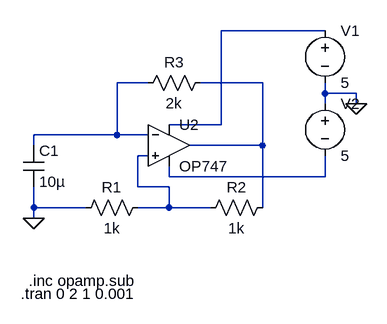
[diagram p0: schematic oscilador_opamp.asc]
oscilador_opamp.asc, the LTspice schematic file:
Version 4
SHEET 1 880 680
WIRE 512 -144 352 -144
WIRE 240 -64 192 -64
WIRE 416 -64 320 -64
WIRE 512 -48 512 -64
WIRE 560 -48 512 -48
WIRE 512 -32 512 -48
WIRE 560 -32 560 -48
WIRE 352 0 352 -144
WIRE 352 0 272 0
WIRE 192 16 192 -64
WIRE 192 16 64 16
WIRE 240 16 192 16
WIRE 64 32 64 16
WIRE 416 32 416 -64
WIRE 416 32 304 32
WIRE 240 48 224 48
WIRE 272 80 272 64
WIRE 512 80 512 48
WIRE 512 80 272 80
WIRE 224 96 224 48
WIRE 272 96 224 96
WIRE 64 128 64 96
WIRE 144 128 64 128
WIRE 272 128 272 96
WIRE 272 128 224 128
WIRE 336 128 272 128
WIRE 416 128 416 32
WIRE 64 144 64 128
FLAG 64 144 0
FLAG 560 -32 0
SYMBOL cap 48 32 R0
SYMATTR InstName C1
SYMATTR Value 10µ
SYMBOL res 240 112 R90
WINDOW 0 0 56 VBottom 2
WINDOW 3 32 56 VTop 2
SYMATTR InstName R1
SYMATTR Value 1k
SYMBOL res 432 112 R90
WINDOW 0 0 56 VBottom 2
WINDOW 3 32 56 VTop 2
SYMATTR InstName R2
SYMATTR Value 1k
SYMBOL res 336 -80 R90
WINDOW 0 0 56 VBottom 2
WINDOW 3 32 56 VTop 2
SYMATTR InstName R3
SYMATTR Value 2k
SYMBOL OpAmps\\OP747 272 -32 R0
SYMATTR InstName U2
SYMBOL voltage 512 -160 R0
WINDOW 123 0 0 Left 0
WINDOW 39 0 0 Left 0
SYMATTR InstName V1
SYMATTR Value 5
SYMBOL voltage 512 -48 R0
WINDOW 123 0 0 Left 0
WINDOW 39 0 0 Left 0
SYMATTR InstName V2
SYMATTR Value 5
TEXT 56 240 Left 2 !.inc opamp.sub
TEXT 44 260 Left 2 !.tran 0 2 1 0.001

The netlist it stands for:
* oscilador_opamp.asc
C1 N002 0 10µ
R1 N004 0 1k
R2 N003 N004 1k
R3 N003 N002 2k
XU2 N004 N002 N001 N005 N003 OP747  ; pins In+ In- V+ V- OUT
V1 N001 0 5
V2 0 N005 5
.inc opamp.sub
.tran 0 2 1 0.001
.backanno
.end